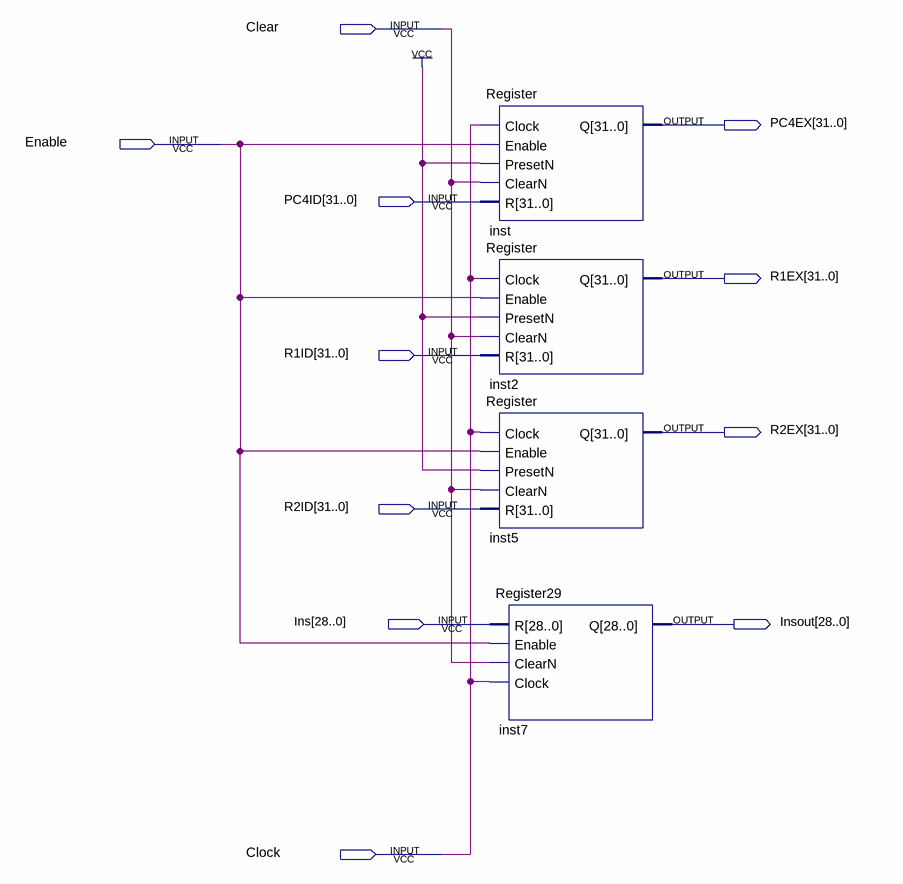
[diagram p0: schematic sheet]
// Quartus schematic BarreiraIDEX_2.bdf as structural Verilog: 4 symbols, 11 pins
module BarreiraIDEX_2 (
  input  Clear,
  input  Enable,
  input  [31:0] PC4ID,
  input  [31:0] R1ID,
  input  [31:0] R2ID,
  input  [28:0] Ins,
  input  Clock,
  output [31:0] PC4EX,
  output [31:0] R1EX,
  output [31:0] R2EX,
  output [28:0] Insout
);

  Register inst (.Clock(Clock), .Enable(Enable), .PresetN(1'b1), .ClearN(Clear), .R(PC4ID), .Q(PC4EX));
  Register inst2 (.Clock(Clock), .Enable(Enable), .PresetN(1'b1), .ClearN(Clear), .R(R1ID), .Q(R1EX));
  Register inst5 (.Clock(Clock), .Enable(Enable), .PresetN(1'b1), .ClearN(Clear), .R(R2ID), .Q(R2EX));
  Register29 inst7 (.R(Ins), .Enable(Enable), .ClearN(Clear), .Clock(Clock), .Q(Insout));
endmodule
